# EAGLE design OSIF (EAGLE 4.16)
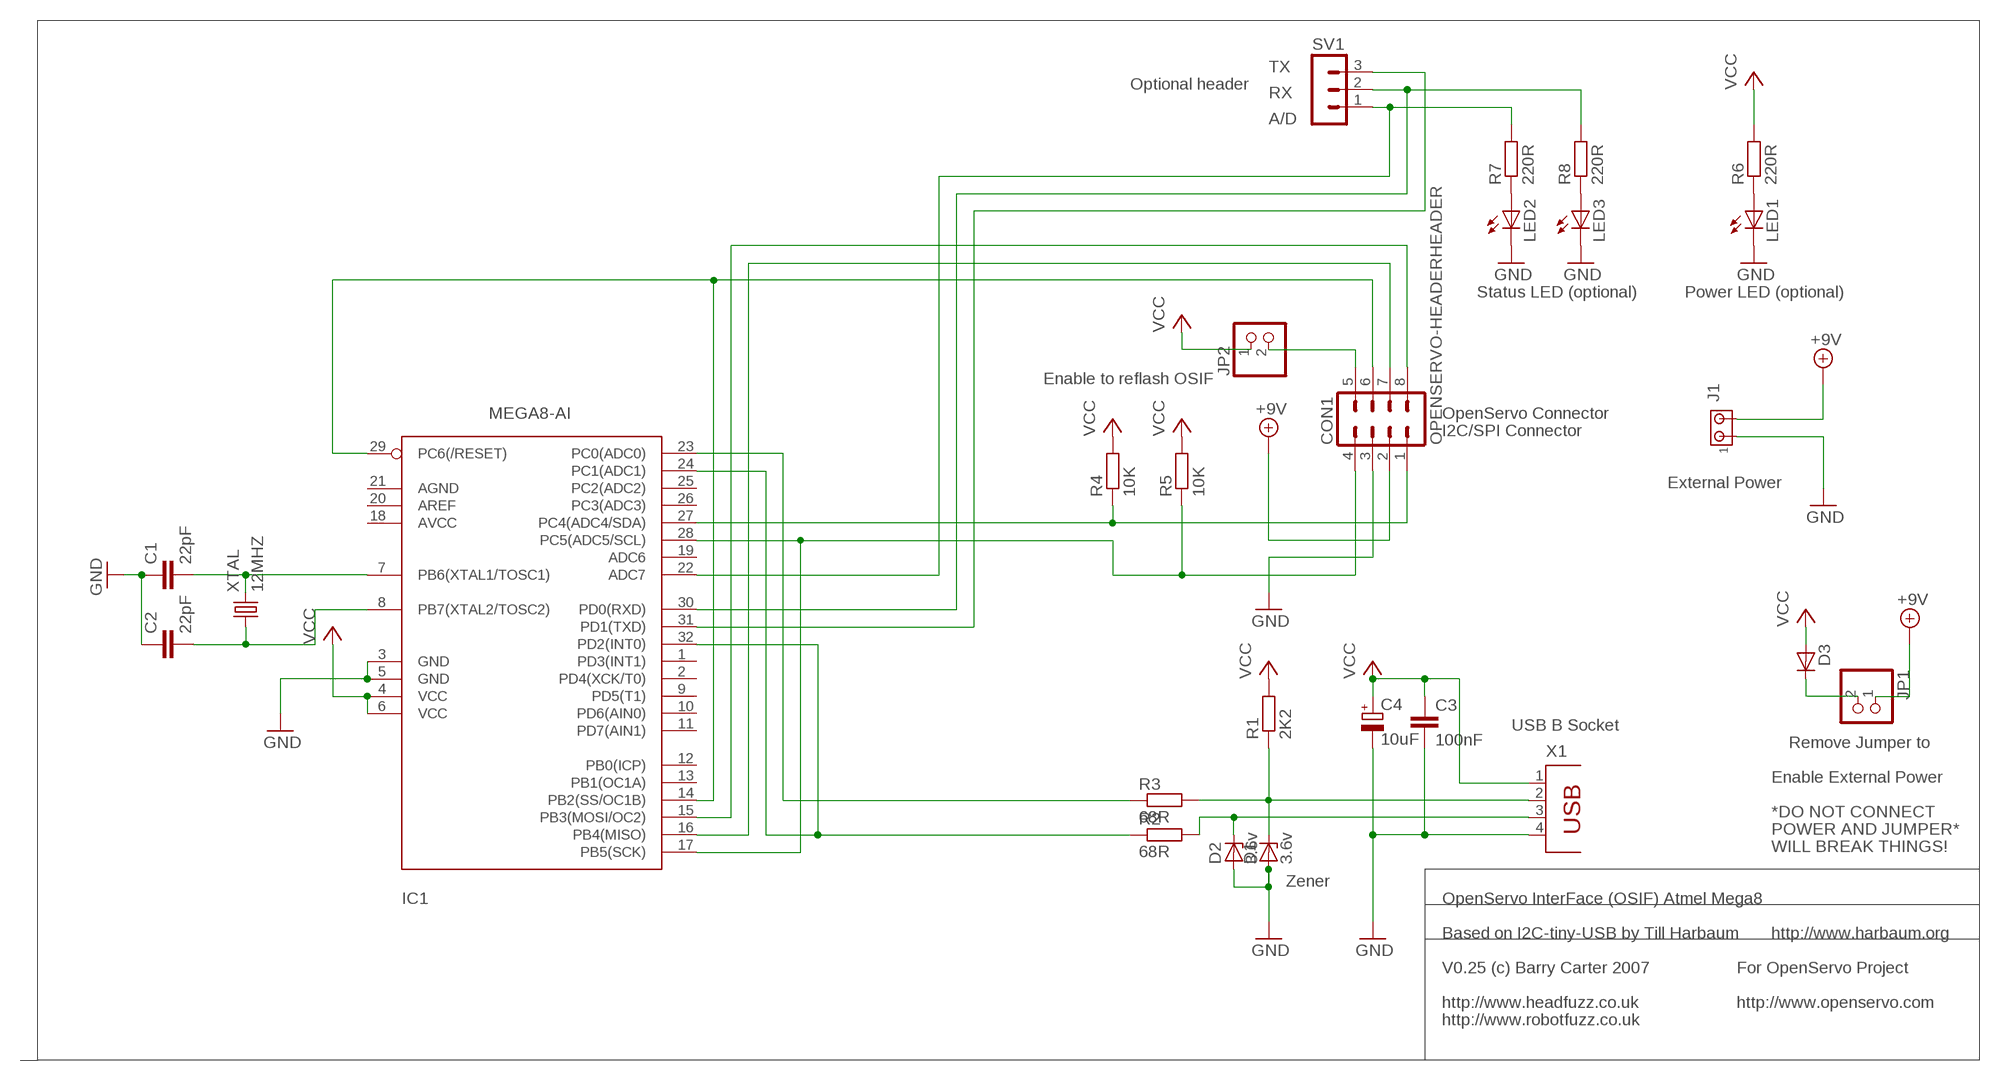
[diagram p0: schematic, sheet 1]

## Parts
C1  22pF  C-EUC0805  [C0805]
C2  22pF  C-EUC0805  [C0805]
C3  100nF  C-EUC0805  [C0805]
C4  10uF  CPOL-EUSMCC  [SMC_C]
CON1  OPENSERVO-HEADERHEADER  [OPENSERVO-HEADER]
D1  3.6v  ZENER-DIODESOT23  [SOT23]
D2  3.6v  ZENER-DIODESOT23  [SOT23]
D3  D-SOD-80  [SOD80]
IC1  MEGA8-AI  [TQFP32-08]
J1  MTA02-100  [10X02MTA]
JP1  PINHD-1X2  [1X02]
JP2  PINHD-1X2  [1X02]
LED1  LEDCHIPLED_0805  [CHIPLED_0805]
LED2  LEDCHIPLED_0805  [CHIPLED_0805]
LED3  LEDCHIPLED_0805  [CHIPLED_0805]
R1  2K2  R-EU_R0805  [R0805]
R2  68R  R-EU_R0805  [R0805]
R3  68R  R-EU_R0805  [R0805]
R4  10K  R-EU_0207/10  [0207/10]
R5  10K  R-EU_0207/10  [0207/10]
R6  220R  R-EU_R0805  [R0805]
R7  220R  R-EU_R0805  [R0805]
R8  220R  R-EU_R0805  [R0805]
SV1  MA03-1  [MA03-1]
X1  PN61729  [PN61729]
XTAL  12MHZ  CRYSTALHC49S  [HC49/S]

## Nets
+9V: CON1.2 J1.2 JP1.1
AD: IC1.22(ADC7) R7.2 SV1.1
GND: C1.1 C2.1 C3.2 C4.- CON1.3 D1.1(A) D2.1(A) IC1.3(GND) IC1.5(GND) J1.1 LED1.C LED2.C LED3.C X1.4
MISO: CON1.7 IC1.16(PB4(MISO))
MOSI: CON1.8 IC1.15(PB3(MOSI/OC2))
N$2: D1.3(C) R1.1 R3.2 X1.2
N$3: CON1.5 JP2.2
N$4: LED1.A R6.1
N$5: LED2.A R7.1
N$6: C2.2 IC1.8(PB7(XTAL2/TOSC2)) XTAL.1
N$7: C1.2 IC1.7(PB6(XTAL1/TOSC1)) XTAL.2
N$8: D3.1(C) JP1.2
N$10: LED3.A R8.1
N$12: D2.3(C) R2.2 X1.3
RESET: CON1.6 IC1.14(PB2(SS/OC1B)) IC1.29(PC6(/RESET))
RX: IC1.30(PD0(RXD)) R8.2 SV1.2
SCL/SCK: CON1.4 IC1.17(PB5(SCK)) IC1.28(PC5(ADC5/SCL)) R5.1
SDA: CON1.1 IC1.27(PC4(ADC4/SDA)) R4.1
TX: IC1.31(PD1(TXD)) SV1.3
USB+: IC1.23(PC0(ADC0)) R3.1
USB-: IC1.24(PC1(ADC1)) IC1.32(PD2(INT0)) R2.1
VCC: C3.1 C4.+ D3.2(A) IC1.4(VCC) IC1.6(VCC) JP2.1 R1.2 R4.2 R5.2 R6.2 X1.1
Unconnected: IC1.1(PD3(INT1)) IC1.2(PD4(XCK/T0)) IC1.9(PD5(T1)) IC1.10(PD6(AIN0)) IC1.11(PD7(AIN1)) IC1.12(PB0(ICP)) IC1.13(PB1(OC1A)) IC1.18(AVCC) IC1.19(ADC6) IC1.20(AREF) IC1.21(AGND) IC1.25(PC2(ADC2)) IC1.26(PC3(ADC3))

## Notes on the sheet
- TX
- Optional header
- RX
- A/D
- Status LED (optional) | Power LED (optional)
- Enable to reflash OSIF
- OpenServo Connector
- I2C/SPI Connector
- External Power
- USB B Socket
- Remove Jumper to
- Enable External Power
- *DO NOT CONNECT
- POWER AND JUMPER*
- WILL BREAK THINGS!
- Zener
- OpenServo InterFace (OSIF) Atmel Mega8
- Based on I2C-tiny-USB by Till Harbaum | http://www.harbaum.org
- V0.25 (c) Barry Carter 2007 | For OpenServo Project
- http://www.headfuzz.co.uk | http://www.openservo.com
- http://www.robotfuzz.co.uk

## Library data of the parts
C1-C3 = rcl:C-EU: CAPACITOR, European symbol
C4 = rcl:CPOL-EU: POLARIZED CAPACITOR, European symbol
CON1 = openservo-header:OPENSERVO-HEADER
D1 D2 = diode:ZENER-DIODE: Z-Diode
D3 = semicon-smd-ipc:D-: DIODE unfilled
IC1 = atmel:MEGA8: MICROCONTROLLER 8 Kbytes FLASH 1 kbytes SRAM 512 bytes EEPROM USART 6-channel 10 bit ADC 2-channel 8 bit ADC Source: avr.lbr
J1 = con-amp:MTA02-100: AMP connector
JP1 JP2 = pinhead:PINHD-1X2: PIN HEADER
LED1-LED3 = led:LED: LED OSRAM: - CHIPLED LG R971, LG N971, LY N971, LG Q971, LY Q971, LO R971, LY R971 LH N974, LH R974 LS Q976, LO Q976, LY Q976 LO Q996 - Hyper CHIPLED LW Q18S LB Q993, LB Q99A, LB R99A - SideLED LS A670, LO A670, LY A670, LG A670, LP A670 LB A673, LV A673, LT A673, LW A673 LH A674 LY A675 LS A676, LA A676, LO A676, LY A676, LW A676 LS A679, LY A679, LG A679 - Hyper Micro SIDELED® LS Y876, LA Y876, LO Y876, LY Y876 LT Y87S - SmartLED LW L88C, LW L88S LB L89C, LB L89S, LG L890 LS L89K, LO L89K, LY L89K LS L896, LA L896, LO L896, LY L896 - TOPLED LS T670, LO T670, LY T670, LG T670, LP T670 LSG T670, LSP T670, LSY T670, LOP T670, LYG T670 LG T671, LOG T671, LSG T671 LB T673, LV T673, LT T673, LW T673 LH T674 LS T676, LA T676, LO T676, LY T676, LB T676, LH T676, LSB T676, LW T676 LB T67C, LV T67C, LT T67C, LS T67K, LO T67K, LY T67K, LW E67C LS E67B, LA E67B, LO E67B, LY E67B, LB E67C, LV E67C, LT E67C LW T67C LS T679, LY T679, LG T679 LS T770, LO T770, LY T770, LG T770, LP T770 LB T773, LV T773, LT T773, LW T773 LH T774 LS E675, LA E675, LY E675, LS T675 LS T776, LA T776, LO T776, LY T776, LB T776 LHGB T686 LT T68C, LB T68C - Hyper Mini TOPLED® LB M676 - Mini TOPLED Santana® LG M470 LS M47K, LO M47K, LY M47K Source: http://www.osram.convergy.de - LUMILED® LXK2-PW12-R00, LXK2-PW12-S00, LXK2-PW14-U00, LXK2-PW14-V00 LXK2-PM12-R00, LXK2-PM12-S00, LXK2-PM14-U00 LXK2-PE12-Q00, LXK2-PE12-R00, LXK2-PE12-S00, LXK2-PE14-T00, LXK2-PE14-U00 LXK2-PB12-K00, LXK2-PB12-L00, LXK2-PB12-M00, LXK2-PB14-N00, LXK2-PB14-P00, LXK2-PB14-Q00 LXK2-PR12-L00, LXK2-PR12-M00, LXK2-PR14-Q00, LXK2-PR14-R00 LXK2-PD12-Q00, LXK2-PD12-R00, LXK2-PD12-S00 LXK2-PH12-R00, LXK2-PH12-S00 LXK2-PL12-P00, LXK2-PL12-Q00, LXK2-PL12-R00 Source: www.luxeon.com
R1-R8 = rcl:R-EU_: RESISTOR, European symbol
SV1 = con-lstb:MA03-1: PIN HEADER
X1 = con-berg:PN61729: BERG USB connector
XTAL = crystal:CRYSTAL: CRYSTAL

## Board
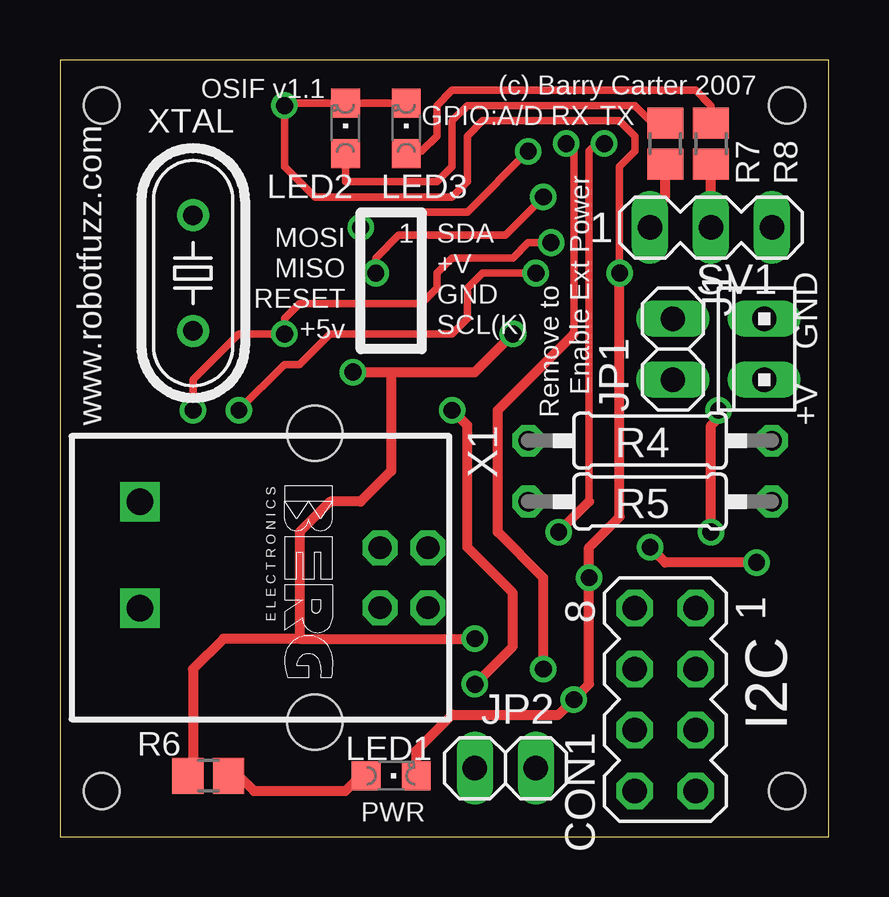
[diagram p1: board, top side]
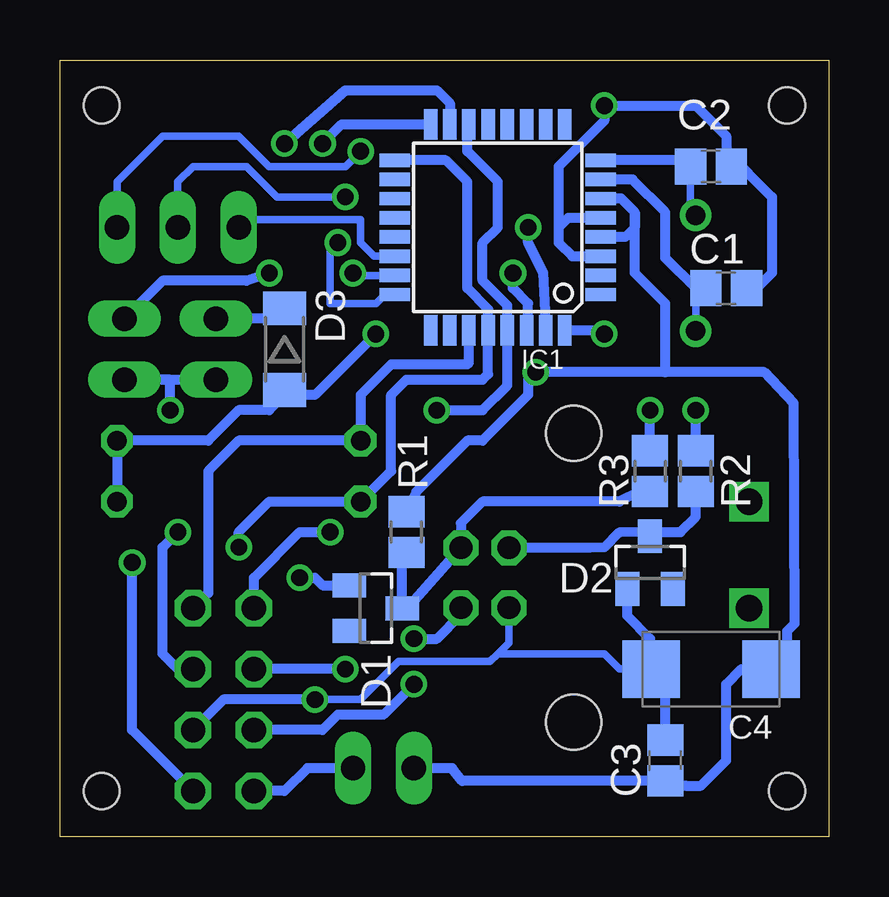
[diagram p2: board, bottom side, seen from below]

Size 32.05 x 32.38 mm. Coordinates in mm from the lower left corner, seen from the top.
Outline: 0,0 32.05,0 32.05,32.38 0,32.38 0,0
Copper layers (1*16): Top 0.035mm / dielectric 1.5mm / Bottom 0.035mm
Design rules "8mils": minimum track width 10mil, minimum drill 24mil, track to track 8mil, track to pad 8mil, pad to pad 8mil, via to via 8mil, smd to smd 8mil, copper to edge 40mil, drill to drill 10mil, minimum pad ring 10mil, minimum via ring 8mil, stop-mask expansion 0mil, vias tented up to drill 0mil, thermal gap 10mil
Holes 1.5 mm at 1.74,30.48 30.32,1.9 30.32,30.48 1.74,1.9

### Footprints (pad centres in the part's own frame; a part is rotated, then mirrored left to right if it is on the bottom)
C0805 = smd 1.3 x 1.5: 1 -0.85,0; 2 0.85,0
SMC_C = smd 2.4 x 2.4: + -2.5,0; - 2.5,0
OPENSERVO-HEADER = drill 1.016 octagon: 1 3.81,-1.27; 2 1.27,-1.27; 3 -1.27,-1.27; 4 -3.81,-1.27; 5 -3.81,1.27; 6 -1.27,1.27; 7 1.27,1.27; 8 3.81,1.27
SOT23 = smd 1 x 1.4: 1 -0.95,-1.1; 2 0.95,-1.1; 3 0,1.1
SOD80 = smd 1.4 x 1.8: 1 -1.7,0; 2 1.7,0
TQFP32-08 = smd 1.27 x 0.559: 1 -4.293,2.8; 2 -4.293,2; 3 -4.293,1.2; 4 -4.293,0.4; 5 -4.293,-0.4; 6 -4.293,-1.2; 7 -4.293,-2; 8 -4.293,-2.8; 17 4.293,-2.8; 18 4.293,-2; 19 4.293,-1.2; 20 4.293,-0.4; 21 4.293,0.4; 22 4.293,1.2; 23 4.293,2; 24 4.293,2.8 | smd 0.559 x 1.27: 9 -2.8,-4.293; 10 -2,-4.293; 11 -1.2,-4.293; 12 -0.4,-4.293; 13 0.4,-4.293; 14 1.2,-4.293; 15 2,-4.293; 16 2.8,-4.293; 25 2.8,4.293; 26 2,4.293; 27 1.2,4.293; 28 0.4,4.293; 29 -0.4,4.293; 30 -1.2,4.293; 31 -2,4.293; 32 -2.8,4.293
10X02MTA = drill 1.016 long: 1 1.27,0; 2 -1.27,0
1X02 = drill 1.016 long: 1 -1.27,0; 2 1.27,0
CHIPLED_0805 = smd 1.2 x 1.2: A 0,-1.05; C 0,1.05
R0805 = smd 1.3 x 1.5: 1 -0.85,0; 2 0.85,0
0207/10 = drill 0.813 octagon: 1 -5.08,0; 2 5.08,0
MA03-1 = drill 1.016 long: 1 -2.54,0; 2 0,0; 3 2.54,0
PN61729 = drill 0.95 octagon: 1 1.25,4.71; 2 -1.25,4.71; 3 -1.25,2.71; 4 1.25,2.71 | hole 2.3: -6.02,0; 6.02,0
HC49/S = drill 0.813 round: 1 -2.413,0; 2 2.413,0

### Placement (x,y rotation side)
C1  4.28,22.86 180 bottom
C2  4.92,27.94 180 bottom
C3  6.82,3.17 90 bottom
C4  4.92,6.98 180 bottom
CON1  25.23,5.71 90 top
D1  18.89,9.52 270 bottom
D2  7.46,11.42 0 bottom
D3  22.7,20.32 270 bottom
IC1  13.81,25.39 180 bottom
J1  29.36,20.32 90 top
JP1  25.55,20.32 90 top
JP2  18.57,2.85 0 top
LED1  13.81,2.54 270 top
LED2  11.9,29.52 0 top
LED3  14.44,29.52 0 top
R1  17.62,12.69 90 bottom
R2  5.55,15.23 270 bottom
R3  7.46,15.23 270 bottom
R4  24.6,16.51 0 top
R5  24.6,13.96 0 top
R6  6.18,2.54 180 top
R7  25.23,28.89 270 top
R8  27.14,28.89 270 top
SV1  27.14,25.39 0 top
X1  10.63,10.79 270 top
XTAL  5.55,23.49 270 top

### Tracks (layer width: path | path; a pad name or v marks a point on that pad's centre or on a via)
+9V  (via drill 0.7)
  Top 0.406: v27.14,12.69 27.14,17.14 27.46,17.46 v27.46,17.78
  Bottom 0.406: v27.14,12.69 27.78,12.06 27.78,7.62 27.14,6.98 CON1.2 | v27.46,17.78 27.46,19.05 27.78,19.05 | 27.78,19.05 J1.2 | 27.78,19.05 JP1.1
AD
  Top 0.406: SV1.1 24.6,26.03 25.23,26.67 R7.2
  Bottom 0.305: IC1.22 18.96,24.2 19.52,24.76 19.52,25.71 23.96,25.71 SV1.1
GND  (via drill 0.7)
  Top 0.305: v23.33,23.49 23.33,27.94 23.96,28.57 23.96,29.21 23.33,29.84 17.62,29.84 16.98,29.21 16.98,27.3 16.35,26.67 10.63,26.67 9.36,27.94 v9.36,30.48 9.78,30.57 LED2.C LED3.C
  Top 0.406: v23.33,23.49 23.33,13.33 22.06,12.06 v22.06,10.79 22.06,6.34 v21.43,5.71 20.79,5.08 16.35,5.08 14.86,3.58 LED1.C
  Bottom 0.305: v21.43,5.71 19.52,5.71 17.93,7.3 14.12,7.3 13.81,7.62 | X1.4 13.34,8.08 13.81,7.62 | 13.81,7.62 9.36,7.62 8.73,6.98 7.46,6.98
  Bottom 0.406: C3.2 6.82,6.34 7.46,6.98 | 7.46,6.98 7.67,7.2 | D2.1 8.41,9.2 7.46,8.25 7.46,7.62 6.82,6.98 C4.- 7.46,6.98 | 19.84,10.47 D1.1 21.11,10.47 21.43,10.79 v22.06,10.79 | 3.65,22.86 C1.1 3.01,22.86 | 3.65,22.86 3.43,23.07 | IC1.5 10.87,25.8 11.27,25.39 | 11.27,25.39 11.27,24.76 10.7,24.2 IC1.3 | 3.01,22.86 3.65,22.86 | 11.27,25.39 11.27,27.94 9.36,29.84 v9.36,30.48 5.55,30.48 4.28,29.21 4.28,28.57 | J1.1 27.78,23.17 24.28,23.17 v23.33,23.49 | 4.28,28.57 C2.1 | 4.28,28.57 2.38,26.67 2.38,23.49 3.01,22.86 | v21.43,5.71 25.23,5.71 CON1.3
MISO  (via drill 0.7)
  Top 0.305: 21.43,20.95 21.43,28.57 v21.11,28.89
  Top 0.406: 21.43,20.95 18.25,17.78 18.25,12.69 20.16,10.79 v20.16,6.98
  Bottom 0.406: IC1.16 20.31,29.69 v21.11,28.89 | v20.16,6.98 CON1.7
MOSI  (via drill 0.7)
  Top 0.305: 22.06,13.96 22.06,28.57 22.38,28.89 v22.7,28.89
  Top 0.406: v20.79,12.69 22.06,13.96
  Bottom 0.406: IC1.15 15.81,30.57 16.35,31.11 20.16,31.11 v22.7,28.89 | v20.79,12.69 22.06,12.69 23.96,10.79 CON1.8
N$2
  Bottom 0.406: R1.1 17.62,12.06 17.79,11.59 D1.3 17.62,9.52 17.6,9.5 X1.2 15.34,13.06 14.44,13.96 8.73,13.96 7.87,14.38 R3.2
N$3
  Bottom 0.406: CON1.5 22.7,1.9 21.74,2.85 JP2.2
N$4
  Top 0.406: R6.1 7.46,2.54 8.09,1.9 11.9,1.9 12.54,2.54 LED1.A
N$5
  Top 0.305: R7.1 24.7,29.74 23.96,30.48 16.98,30.48 16.35,29.84 16.35,27.94 15.71,27.3 11.9,27.3 LED2.A
N$6
  Bottom 0.305: XTAL.1 5.55,26.03 5.76,26.25 5.76,27.52 6.18,27.94 6.18,28.2
  Bottom 0.406: C2.2 5.55,27.94 5.81,28.2 6.18,28.2 IC1.8
N$7
  Bottom 0.305: XTAL.2 5.55,22.22 4.92,22.86 C1.2
  Bottom 0.406: IC1.7 8.19,27.39 6.82,26.03 6.82,24.12 5.55,22.86 C1.2
N$8
  Bottom 0.406: D3.1 22.7,22.22 23.33,21.59 JP1.2
N$9  (via drill 1.1)
  other vias: 3.33,9.52
N$10
  Top 0.305: R8.1 27.14,30.48 26.51,31.11 16.35,31.11 15.71,30.48 15.71,29.21 15.08,28.57 LED3.A
N$11  (via drill 1.1)
  other vias: 3.33,13.96
N$12
  Bottom 0.406: X1.3 9.98,12.04 9.36,12.06 8.75,12.67 7.46,12.69 | R2.2 5.55,13.33 6.18,12.69 7.46,12.69 | D2.3 7.46,12.69
RESET  (via drill 0.7)
  Top 0.406: v16.35,17.78 16.98,17.14 16.98,12.06 18.89,10.15 18.89,7.93 v17.3,6.34
  Bottom 0.406: v16.35,17.78 14.44,17.78 13.41,18.81 IC1.29 13.41,22.14 14.44,23.17 14.44,24.76 13.81,25.39 13.81,27.3 15.08,28.57 15.08,29.62 IC1.14 | v17.3,6.34 18.57,5.08 20.47,5.08 21.11,4.44 CON1.6
RX  (via drill 0.7)
  Top 0.305: v20.16,26.67 18.57,25.08 14.12,25.08 13.17,24.12 v13.17,23.49
  Top 0.406: SV1.2 R8.2
  Bottom 0.305: SV1.2 27.14,27.3 26.51,27.94 24.28,27.94 23.01,26.67 v20.16,26.67
  Bottom 0.406: v13.17,23.49 13.17,22.86 12.54,22.22 12.54,20.95 12.61,21.02 IC1.30
SCL/SCK  (via drill 0.7)
  Top 0.406: v29.05,11.42 25.23,11.42 v24.6,12.06
  Bottom 0.406: IC1.17 15.97,28.2 15.08,27.3 15.08,22.86 14.21,21.98 IC1.28 14.21,19.28 14.44,19.05 17.62,19.05 18.25,18.41 18.25,15.23 R5.1 23.33,13.96 24.6,12.69 v24.6,12.06 | v29.05,11.42 29.05,4.44 CON1.4
SDA
  Bottom 0.406: IC1.27 15.01,19.75 15.08,19.68 18.25,19.68 19.52,18.41 R4.1 24.6,16.51 25.87,15.23 25.87,10.15 CON1.1
TX  (via drill 0.7)
  Top 0.305: v19.52,28.57 16.98,26.03 12.54,26.03 v12.54,25.39
  Bottom 0.305: SV1.3 29.68,27.3 27.78,29.21 24.6,29.21 23.33,27.94 20.16,27.94 v19.52,28.57
  Bottom 0.406: IC1.31 11.81,21.49 11.9,23.49 12.54,24.76 v12.54,25.39
USB+  (via drill 0.7)
  Top 0.305: v7.46,17.78 9.36,19.68 10,19.68 11.27,20.95 16.35,20.95 16.98,21.59 16.98,22.86 17.62,23.49 v19.84,23.49
  Bottom 0.305: 19.43,23.39 IC1.23
  Bottom 0.406: R3.1 v7.46,17.78 | v19.84,23.49 19.43,23.39
USB-  (via drill 0.7)
  Top 0.305: v20.47,24.76 19.52,24.76 18.89,24.12 16.35,24.12 15.71,23.49 15.71,22.86 15.08,22.22 10,22.22 9.36,21.59 v9.36,20.95 7.46,20.95 5.55,19.05 v5.55,17.78
  Bottom 0.305: 20.79,24.76 20.79,22.22 18.89,22.22 18.51,22.6
  Bottom 0.406: 5.55,15.87 R2.1 v5.55,17.78 | v20.47,24.76 20.79,24.76 | 18.51,22.6 IC1.24 | IC1.32 9.36,21.1 v9.36,20.95
VCC  (via drill 0.7)
  Top 0.406: v12.22,19.36 13.81,19.36 | 13.81,19.36 17.3,19.36 v18.89,20.95 | 10,8.25 10,12.69 11.27,13.96 12.54,13.96 13.81,15.23 13.81,19.36 | 10,8.25 6.82,8.25 5.55,6.98 5.55,2.54 R6.2 | 10,8.25 v17.3,8.25
  Bottom 0.406: R5.2 R4.2 25.87,16.51 24.6,17.78 23.33,17.78 22.7,18.41 | C4.+ 2.38,6.98 | C4.+ 3.65,6.98 4.28,6.34 4.28,3.17 5.33,2.12 5.97,2.12 C3.1 15.29,2.32 15.71,2.85 JP2.1 | C4.+ 2.42,6.94 1.74,6.98 1.74,8.57 1.42,8.88 1.46,18.05 2.69,19.36 6.82,19.36 | R1.2 17.2,14.38 15.08,16.51 14.44,16.51 12.54,18.41 12.54,19.05 v12.22,19.36 6.82,19.36 | IC1.6 8.66,26.6 8.09,26.03 | IC1.4 8.49,25 8.09,25.39 8.09,26.03 | 6.82,19.36 6.82,22.22 8.09,23.49 8.09,26.03 | v18.89,20.95 21.43,18.41 22.7,18.41 | X1.1 15.34,9.25 16.35,8.25 v17.3,8.25 | 22.7,18.41 D3.2

### Text on the board
tPlace: (c) Barry Carter 2007 | GND | www.robotfuzz.com | +V | I2C
tNames: OSIF v1.1 | GPIO: | A/D | RX | TX | MOSI | 1 | SDA | MISO | RESET | +V | +5v | GND | SCL(K) | Enable Ext Power | Remove to | PWR